# Altium schematic sheet Sheet1.SchDoc
size A
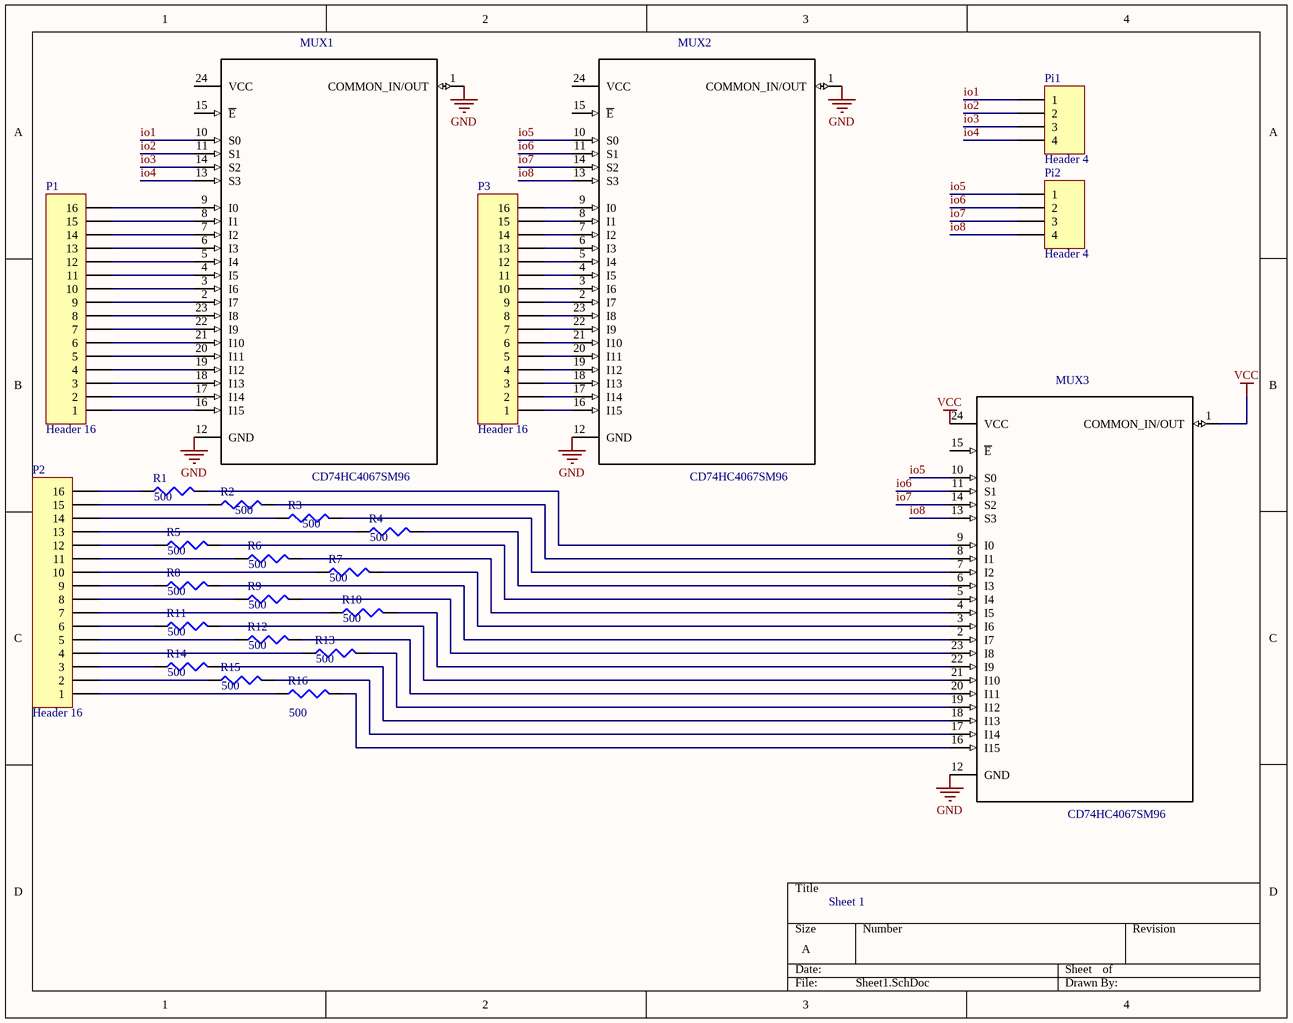
[diagram p0: Sheet1.SchDoc]

## Parts
MUX1  CD74HC4067SM96  [SOP65P780X200-24N]
MUX2  CD74HC4067SM96  [SOP65P780X200-24N]
MUX3  CD74HC4067SM96  [SOP65P780X200-24N]
P1  Header 16  [HDR1X16]
P2  Header 16  [HDR1X16]
P3  Header 16  [HDR1X16]
Pi1  Header 4  [HDR1X4]
Pi2  Header 4  [HDR1X4]
R1  value 500  [J1-0603]  (hidden comment: Res3)
R2  value 500  [J1-0603]  (hidden comment: Res3)
R3  value 500  [J1-0603]  (hidden comment: Res3)
R4  value 500  [J1-0603]  (hidden comment: Res3)
R5  value 500  [J1-0603]  (hidden comment: Res3)
R6  value 500  [J1-0603]  (hidden comment: Res3)
R7  value 500  [J1-0603]  (hidden comment: Res3)
R8  value 500  [J1-0603]  (hidden comment: Res3)
R9  value 500  [J1-0603]  (hidden comment: Res3)
R10  value 500  [J1-0603]  (hidden comment: Res3)
R11  value 500  [J1-0603]  (hidden comment: Res3)
R12  value 500  [J1-0603]  (hidden comment: Res3)
R13  value 500  [J1-0603]  (hidden comment: Res3)
R14  value 500  [J1-0603]  (hidden comment: Res3)
R15  value 500  [J1-0603]  (hidden comment: Res3)
R16  value 500  [J1-0603]  (hidden comment: Res3)

## Nets
GND: MUX1.1(COMMON_IN/OUT) MUX1.12(GND) MUX2.1(COMMON_IN/OUT) MUX2.12(GND) MUX3.12(GND)
VCC: MUX3.1(COMMON_IN/OUT) MUX3.24(VCC)
io1: MUX1.10(S0) Pi1.1
io2: MUX1.11(S1) Pi1.2
io3: MUX1.14(S2) Pi1.3
io4: MUX1.13(S3) Pi1.4
io5: MUX2.10(S0) MUX3.10(S0) Pi2.1
io6: MUX2.11(S1) MUX3.11(S1) Pi2.2
io7: MUX2.14(S2) MUX3.14(S2) Pi2.3
io8: MUX2.13(S3) MUX3.13(S3) Pi2.4
NetMUX1_2: MUX1.2(I7) P1.9
NetMUX1_3: MUX1.3(I6) P1.10
NetMUX1_4: MUX1.4(I5) P1.11
NetMUX1_5: MUX1.5(I4) P1.12
NetMUX1_6: MUX1.6(I3) P1.13
NetMUX1_7: MUX1.7(I2) P1.14
NetMUX1_8: MUX1.8(I1) P1.15
NetMUX1_9: MUX1.9(I0) P1.16
NetMUX1_16: MUX1.16(I15) P1.1
NetMUX1_17: MUX1.17(I14) P1.2
NetMUX1_18: MUX1.18(I13) P1.3
NetMUX1_19: MUX1.19(I12) P1.4
NetMUX1_20: MUX1.20(I11) P1.5
NetMUX1_21: MUX1.21(I10) P1.6
NetMUX1_22: MUX1.22(I9) P1.7
NetMUX1_23: MUX1.23(I8) P1.8
NetMUX2_2: MUX2.2(I7) P3.9
NetMUX2_3: MUX2.3(I6) P3.10
NetMUX2_4: MUX2.4(I5) P3.11
NetMUX2_5: MUX2.5(I4) P3.12
NetMUX2_6: MUX2.6(I3) P3.13
NetMUX2_7: MUX2.7(I2) P3.14
NetMUX2_8: MUX2.8(I1) P3.15
NetMUX2_9: MUX2.9(I0) P3.16
NetMUX2_16: MUX2.16(I15) P3.1
NetMUX2_17: MUX2.17(I14) P3.2
NetMUX2_18: MUX2.18(I13) P3.3
NetMUX2_19: MUX2.19(I12) P3.4
NetMUX2_20: MUX2.20(I11) P3.5
NetMUX2_21: MUX2.21(I10) P3.6
NetMUX2_22: MUX2.22(I9) P3.7
NetMUX2_23: MUX2.23(I8) P3.8
NetMUX3_2: MUX3.2(I7) R8.2
NetMUX3_3: MUX3.3(I6) R7.2
NetMUX3_4: MUX3.4(I5) R6.2
NetMUX3_5: MUX3.5(I4) R5.2
NetMUX3_6: MUX3.6(I3) R4.2
NetMUX3_7: MUX3.7(I2) R3.2
NetMUX3_8: MUX3.8(I1) R2.2
NetMUX3_9: MUX3.9(I0) R1.2
NetMUX3_16: MUX3.16(I15) R16.2
NetMUX3_17: MUX3.17(I14) R15.2
NetMUX3_18: MUX3.18(I13) R14.2
NetMUX3_19: MUX3.19(I12) R13.2
NetMUX3_20: MUX3.20(I11) R12.2
NetMUX3_21: MUX3.21(I10) R11.2
NetMUX3_22: MUX3.22(I9) R10.2
NetMUX3_23: MUX3.23(I8) R9.2
NetP2_1: P2.1 R16.1
NetP2_2: P2.2 R15.1
NetP2_3: P2.3 R14.1
NetP2_4: P2.4 R13.1
NetP2_5: P2.5 R12.1
NetP2_6: P2.6 R11.1
NetP2_7: P2.7 R10.1
NetP2_8: P2.8 R9.1
NetP2_9: P2.9 R8.1
NetP2_10: P2.10 R7.1
NetP2_11: P2.11 R6.1
NetP2_12: P2.12 R5.1
NetP2_13: P2.13 R4.1
NetP2_14: P2.14 R3.1
NetP2_15: P2.15 R2.1
NetP2_16: P2.16 R1.1

Not connected (* = marked no-connect by the designer): MUX1 15(~{E}) 24(VCC); MUX2 15(~{E}) 24(VCC); MUX3 15(~{E})

## Notes on the sheet
- Sheet 1

## Library data of the parts
MUX1-MUX3 = CD74HC4067SM96: High Speed CMOS 16-Channel Analog Multiplexer/Demultiplexer 24-SSOP -55 to 125; MF: Texas Instruments; MP: CD74HC4067SM96; Price: None; Availability: Unavailable; Package: SSOP-24 Texas Instruments; SnapEDA_Link: https://www.snapeda.com/parts/CD74HC4067SM96/Texas%20Instruments/view-part/?ref=snap; Value: *
P1-P3 = Header 16: Header, 16-Pin; LatestRevisionDate: 17-Jul-2002; LatestRevisionNote: Re-released for DXP Platform.; Publisher: Altium Limited
Pi1 Pi2 = Header 4: Header, 4-Pin; LatestRevisionDate: 17-Jul-2002; LatestRevisionNote: Re-released for DXP Platform.; Publisher: Altium Limited
R1-R16 = Res3: Resistor; Published: 8-Jun-2000; LatestRevisionDate: 29-May-2009; LatestRevisionNote: IPC-7351 Footprint Added.; PackageReference: J1-0603; Publisher: Altium Limited; PackageDescription: Chip Resistor